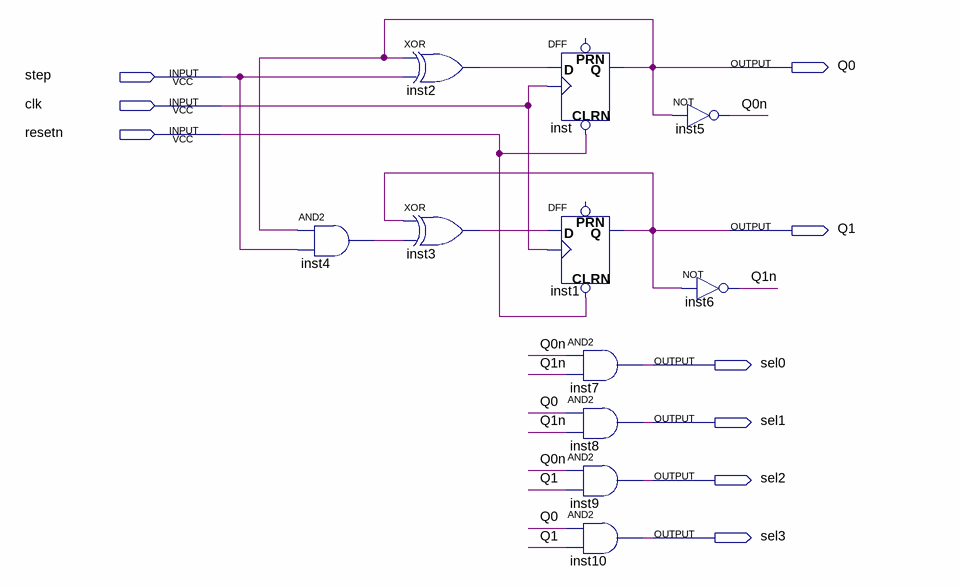
[diagram p0: schematic sheet]
// Quartus schematic ctr_sel.bdf as structural Verilog: 11 symbols, 9 pins
module ctr_sel (
  input  step,
  input  clk,
  input  resetn,
  output Q0,
  output Q1,
  output sel0,
  output sel1,
  output sel2,
  output sel3
);

  wire inst2_out, inst3_out, inst4_out, Q0n, Q1n;

  and inst4 (inst4_out, Q0, step);
  xor inst2 (inst2_out, Q0, step);
  xor inst3 (inst3_out, Q1, inst4_out);
  DFF inst (.CLRN(resetn), .CLK(clk), .D(inst2_out), .Q(Q0));  // open: PRN
  DFF inst1 (.CLRN(resetn), .CLK(clk), .D(inst3_out), .Q(Q1));  // open: PRN
  and inst7 (sel0, Q0n, Q1n);
  and inst8 (sel1, Q0, Q1n);
  and inst9 (sel2, Q0n, Q1);
  and inst10 (sel3, Q0, Q1);
  not inst5 (Q0n, Q0);
  not inst6 (Q1n, Q1);
endmodule
